# Altium schematic sheet decoder.SchDoc: 3-to-8 Decoder
size 209 x 148 mm; Revision: 1.0.0; SheetNumber: 5; SheetTotal: 10
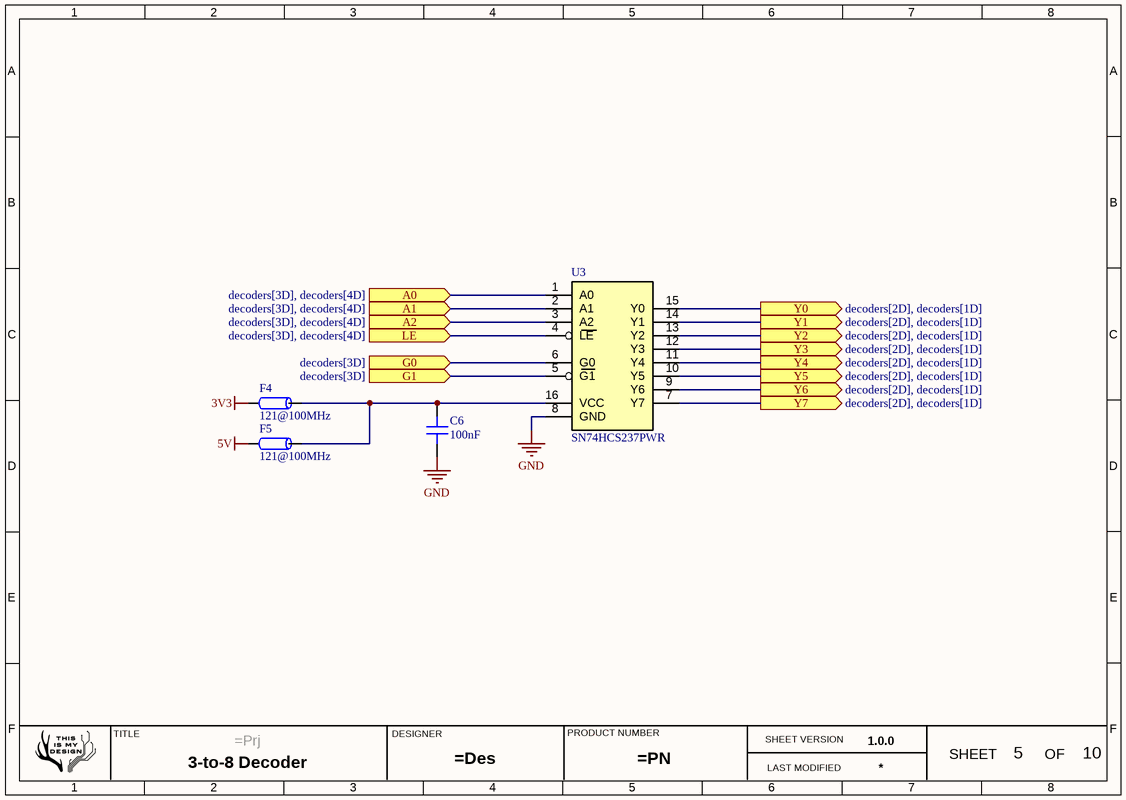
[diagram p0: decoder.SchDoc]

## Parts
C6  100nF  [CAP 0603_1608]
F4  121@100MHz  [Ferrite-0805]
F5  121@100MHz  [Ferrite-0805]
U3  SN74HCS237PWR  [TSSOP-16]

## Ports
A0 (in, see decoders[3D], decoders[4D]), A1 (in, see decoders[3D], decoders[4D]), A2 (in, see decoders[3D], decoders[4D]), G0 (in, see decoders[3D]), G1 (in, see decoders[3D]), LE (in, see decoders[3D], decoders[4D]), Y0 (out, see decoders[2D], decoders[1D]), Y1 (out, see decoders[2D], decoders[1D]), Y2 (out, see decoders[2D], decoders[1D]), Y3 (out, see decoders[2D], decoders[1D]), Y4 (out, see decoders[2D], decoders[1D]), Y5 (out, see decoders[2D], decoders[1D]), Y6 (out, see decoders[2D], decoders[1D]), Y7 (out, see decoders[2D], decoders[1D])

## Nets
3V3: F4.1
5V: F5.1
GND: C6.1 U3.8(GND)
A0: U3.1(A0) ; port A0
A1: U3.2(A1) ; port A1
A2: U3.3(A2) ; port A2
G0: U3.6(G0) ; port G0
G1: U3.5(G1) ; port G1
LE: U3.4(LE) ; port LE
Y0: U3.15(Y0) ; port Y0
Y1: U3.14(Y1) ; port Y1
Y2: U3.13(Y2) ; port Y2
Y3: U3.12(Y3) ; port Y3
Y4: U3.11(Y4) ; port Y4
Y5: U3.10(Y5) ; port Y5
Y6: U3.9(Y6) ; port Y6
Y7: U3.7(Y7) ; port Y7
NetC6_2: C6.2 F4.2 F5.2 U3.16(VCC)

## Notes on the sheet
- TITLE
- DESIGNER
- PRODUCT NUMBER
- SHEET VERSION
- SHEET
- OF
- LAST MODIFIED

## Library data of the parts
C6 = Cap 0603: SMT Capacitor; VALUE: 100nF
F4 F5 = Ferrite Bead
U3 = SN74HCS237: High speed CMOS logic 3-to-8 line decoder demultiplexer with address latches